# Altium project LM-004-B.PrjPcb
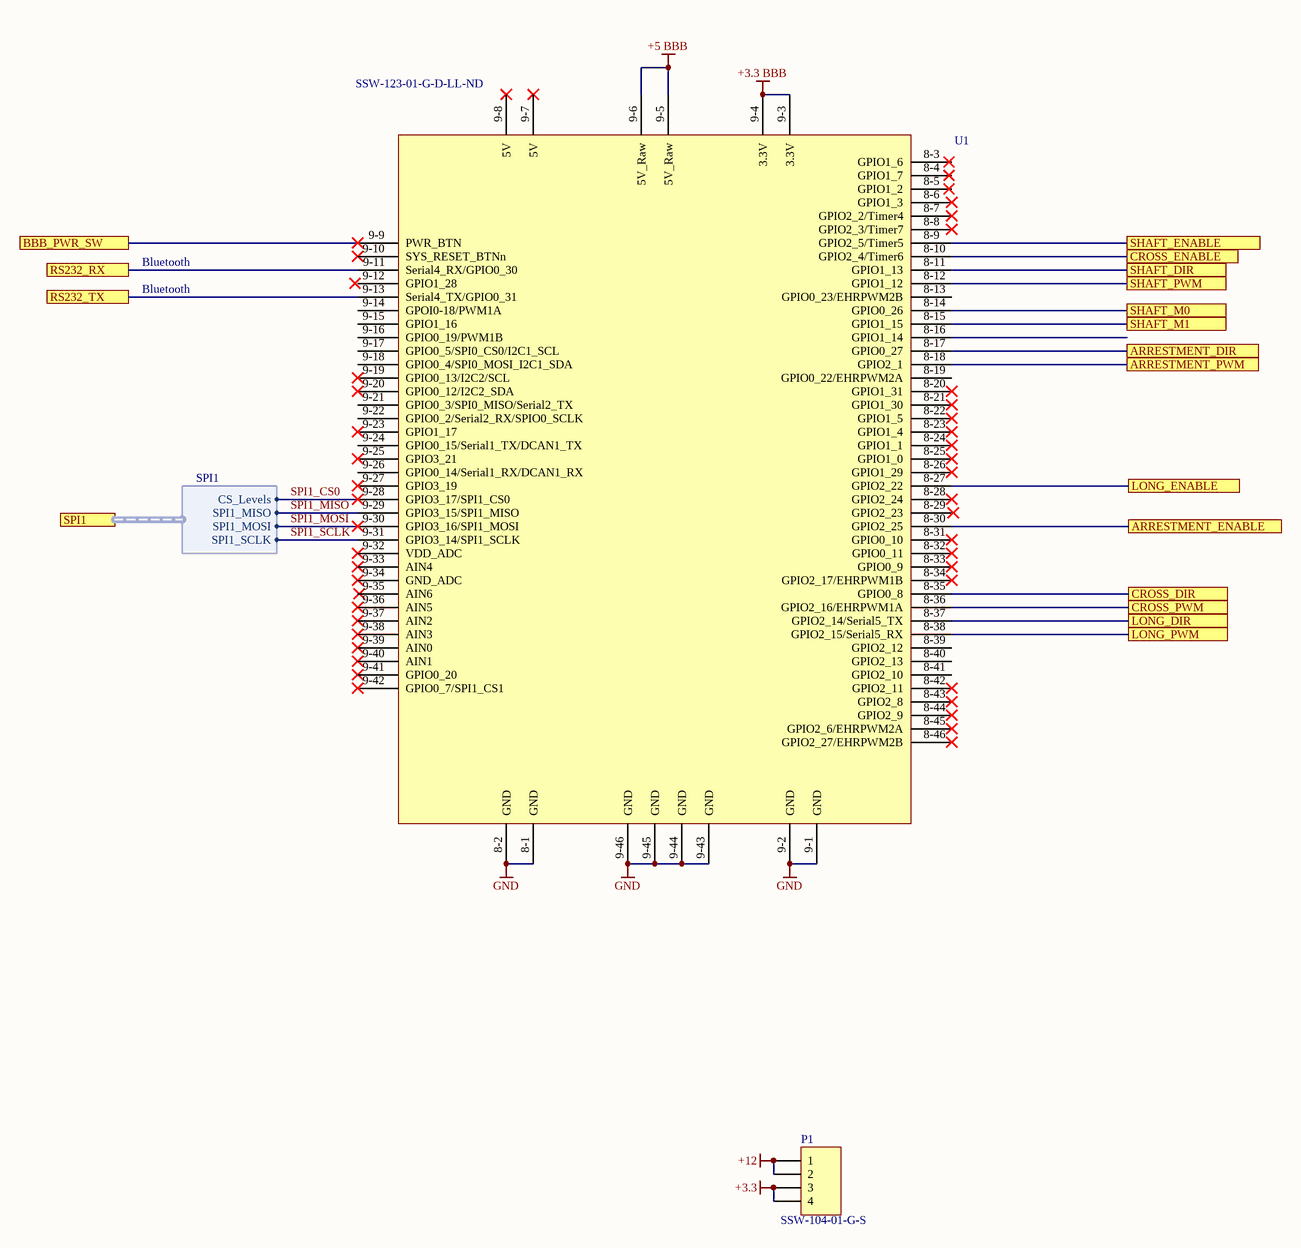
[diagram p0: BBB_Connections.SchDoc]
4 sheets, 42 parts. Net scope: flat (ports and power ports of the same name join across sheets).
Board file: LM-004-B.PcbDoc
Sheets:
  BBB_Connections.SchDoc
  Bluetooth.SchDoc
  Stepper Motor Driver.SchDoc
  Magnetic_Encoder.SchDoc

## Sheet BBB_Connections.SchDoc: BBB Connections
size Tabloid; DocumentNumber: LM-004; Revision: C; SheetNumber: 3; SheetTotal: 4

### Parts
P1  SSW-104-01-G-S  [HDR1X4]
U1  Supplier Part Number 1: SSW-123-01-G-D-LL-ND  [Beaglebone Black Mezanine]  (hidden comment: BBB)

### Ports
ARRESTMENT_DIR, ARRESTMENT_ENABLE, ARRESTMENT_PWM, BBB_PWR_SW, CROSS_DIR, CROSS_ENABLE, CROSS_PWM, LONG_DIR, LONG_ENABLE, LONG_PWM, RS232_RX, RS232_TX, SHAFT_DIR, SHAFT_ENABLE, SHAFT_M0, SHAFT_M1, SHAFT_PWM, SPI1 (harness SPI1)

### Harnesses
SPI1: CS_Levels, SPI1_MISO, SPI1_MOSI, SPI1_SCLK

### Nets
+3.3: P1.3 P1.4
+3.3 BBB: U1.9-3(3.3V) U1.9-4(3.3V)
+5 BBB: U1.9-5(5V_Raw) U1.9-6(5V_Raw)
+12: P1.1 P1.2
GND: U1.8-1(GND) U1.8-2(GND) U1.9-1(GND) U1.9-2(GND) U1.9-43(GND) U1.9-44(GND) U1.9-45(GND) U1.9-46(GND)
RS232_RX: U1.9-11(Serial4_RX/GPIO0_30) ; port RS232_RX
RS232_TX: U1.9-13(Serial4_TX/GPIO0_31) ; port RS232_TX
SPI1_CS0: U1.9-28(GPIO3_17/SPI1_CS0) ; port SPI1.CS_Levels
SPI1_MISO: U1.9-29(GPIO3_15/SPI1_MISO) ; port SPI1.SPI1_MISO
SPI1_MOSI: U1.9-30(GPIO3_16/SPI1_MOSI) ; port SPI1.SPI1_MOSI
SPI1_SCLK: U1.9-31(GPIO3_14/SPI1_SCLK) ; port SPI1.SPI1_SCLK
NetU1_8-9: U1.8-9(GPIO2_5/Timer5) ; port SHAFT_ENABLE
NetU1_8-10: U1.8-10(GPIO2_4/Timer6) ; port CROSS_ENABLE
NetU1_8-11: U1.8-11(GPIO1_13) ; port SHAFT_DIR
NetU1_8-12: U1.8-12(GPIO1_12) ; port SHAFT_PWM
NetU1_8-14: U1.8-14(GPIO0_26) ; port SHAFT_M0
NetU1_8-15: U1.8-15(GPIO1_15) ; port SHAFT_M1
NetU1_8-17: U1.8-17(GPIO0_27) ; port ARRESTMENT_DIR
NetU1_8-18: U1.8-18(GPIO2_1) ; port ARRESTMENT_PWM
NetU1_8-27: U1.8-27(GPIO2_22) ; port LONG_ENABLE
NetU1_8-30: U1.8-30(GPIO2_25) ; port ARRESTMENT_ENABLE
NetU1_8-35: U1.8-35(GPIO0_8) ; port CROSS_DIR
NetU1_8-36: U1.8-36(GPIO2_16/EHRPWM1A) ; port CROSS_PWM
NetU1_8-37: U1.8-37(GPIO2_14/Serial5_TX) ; port LONG_DIR
NetU1_8-38: U1.8-38(GPIO2_15/Serial5_RX) ; port LONG_PWM
NetU1_9-9: U1.9-9(PWR_BTN) ; port BBB_PWR_SW

Not connected (* = marked no-connect by the designer): U1 8-3(GPIO1_6) 8-4(GPIO1_7) 8-5(GPIO1_2) 8-6(GPIO1_3)* 8-7(GPIO2_2/Timer4)* 8-8(GPIO2_3/Timer7)* 8-13(GPIO0_23/EHRPWM2B) 8-16(GPIO1_14) 8-19(GPIO0_22/EHRPWM2A) 8-20(GPIO1_31)* 8-21(GPIO1_30)* 8-22(GPIO1_5)* 8-23(GPIO1_4)* 8-24(GPIO1_1)* 8-25(GPIO1_0)* 8-26(GPIO1_29)* 8-28(GPIO2_24)* 8-29(GPIO2_23) 8-31(GPIO0_10)* 8-32(GPIO0_11)* 8-33(GPIO0_9)* 8-34(GPIO2_17/EHRPWM1B)* 8-39(GPIO2_12) 8-40(GPIO2_13) 8-41(GPIO2_10) 8-42(GPIO2_11)* 8-43(GPIO2_8)* 8-44(GPIO2_9)* 8-45(GPIO2_6/EHRPWM2A)* 8-46(GPIO2_27/EHRPWM2B)* 9-7(5V)* 9-8(5V)* 9-10(SYS_RESET_BTNn)* 9-12(GPIO1_28) 9-14(GPOI0-18/PWM1A) 9-15(GPIO1_16) 9-16(GPIO0_19/PWM1B) 9-17(GPIO0_5/SPI0_CS0/I2C1_SCL) 9-18(GPIO0_4/SPI0_MOSI_I2C1_SDA) 9-19(GPIO0_13/I2C2/SCL)* 9-20(GPIO0_12/I2C2_SDA)* 9-21(GPIO0_3/SPI0_MISO/Serial2_TX) 9-22(GPIO0_2/Serial2_RX/SPIO0_SCLK) 9-23(GPIO1_17)* 9-24(GPIO0_15/Serial1_TX/DCAN1_TX) 9-25(GPIO3_21)* 9-26(GPIO0_14/Serial1_RX/DCAN1_RX) 9-27(GPIO3_19)* 9-32(VDD_ADC)* 9-33(AIN4)* 9-34(GND_ADC)* 9-35(AIN6) 9-36(AIN5)* 9-37(AIN2)* 9-38(AIN3)* 9-39(AIN0)* 9-40(AIN1)* 9-41(GPIO0_20)* 9-42(GPIO0_7/SPI1_CS1)*

### Notes on the sheet
- Bluetooth
- Title
- Size:
- Date:
- Tabloid
- Number:
- Time:
- Revision:
- Sheet
- of
- ZLS Corporation
- 7801 North Lamar Blvd.
- Suite E-184
- Austin, Texas 78752  USA
- (512) 453-0288
- File:

### Library data of the parts
P1 = Header 4: Header, 4-Pin; Manufacturer: Samtec Inc.; Connector Type: Receptacle; Style: Board to Board or Cable; Number of Positions: 4; Number of Positions Loaded: All; Pitch - Mating: 0.100" (2.54mm); Contact Length - Post: 0.104" (2.64mm); Material Flammability Rating: UL94 V-0; Current Rating: 5.7A per Contact; Supplier 1: Digi-Key; Supplier Part Number 1: SAM1209-04-ND; Manufacturer Part Number: SSW-104-01-G-S; RoHS: RoHS Compliant; Category: Connectors, Interconnects; Stock 1: 360; Pricing 1: 1=1.85, 10=1.654, 100=1.3623, 500=1.07684, 1000=0.9244, 5000=0.84331, 10000=0.81088 (USD); Packaging: Bulk; Part Status: Active; Contact Type: Forked; Row Spacing - Mating: -; Mounting Type: Through Hole; Termination: Solder; Fastening Type: Push-Pull; Contact Finish - Mating: Gold; Contact Finish Thickness - Mating: 20.0µin (0.51µm); Insulation Color: Black; Insulation Height: 0.335" (8.51mm); Operating Temperature: -55°C ~ 125°C; Contact Finish - Post: Gold; Mated Stacking Heights: -; Ingress Protection: -; Features: -; Voltage Rating: -; Applications: -; Insulation Material: Liquid Crystal Polymer (LCP); Contact Shape: Square; Contact Material: Phosphor Bronze; Contact Finish Thickness - Post: 3.00µin (0.076µm); ComponentLink1URL: http://suddendocs.samtec.com/prints/ssw-1xx-xx-xxx-x-xx-xxx-xx-mkt.pdf; ComponentLink1Description: http://suddendocs.samtec.com/prints/ssw-1xx-xx-xxx-x-xx-xxx-xx-mkt.pdf
U1 = Beaglebone_Black_Mezanine: Beaglebone Black; Manufacturer: Samtec Inc.; Manufacturer Part Number: SSW-123-01-G-D-LL; Connector Type: Receptacle; Style: Board to Board or Cable; Number of Positions: 46; Number of Positions Loaded: All; Pitch - Mating: 0.100" (2.54mm); Contact Length - Post: 0.104" (2.64mm); Material Flammability Rating: UL94 V-0; Current Rating: 5.7A per Contact; Supplier 1: Digi-Key; RoHS: RoHS Compliant; Category: Connectors, Interconnects; Stock 1: 0; Pricing 1: 1=6.07 (USD); Packaging: Bulk; Part Status: Active; Contact Type: Forked; Row Spacing - Mating: 0.100" (2.54mm); Mounting Type: Through Hole; Termination: Kinked Pin, Solder; Fastening Type: Push-Pull; Contact Finish - Mating: Gold; Contact Finish Thickness - Mating: 20.0µin (0.51µm); Insulation Color: Black; Insulation Height: 0.335" (8.51mm); Operating Temperature: -55°C ~ 125°C; Contact Finish - Post: Gold; Mated Stacking Heights: -; Ingress Protection: -; Features: -; Voltage Rating: -; Applications: -; Insulation Material: Liquid Crystal Polymer (LCP); Contact Shape: Square; Contact Material: Phosphor Bronze; Contact Finish Thickness - Post: 3.00µin (0.076µm)

## Sheet Bluetooth.SchDoc: Bluetooth
size OrCAD A; DocumentNumber: LM-004; Revision: C; SheetNumber: 4; SheetTotal: 4
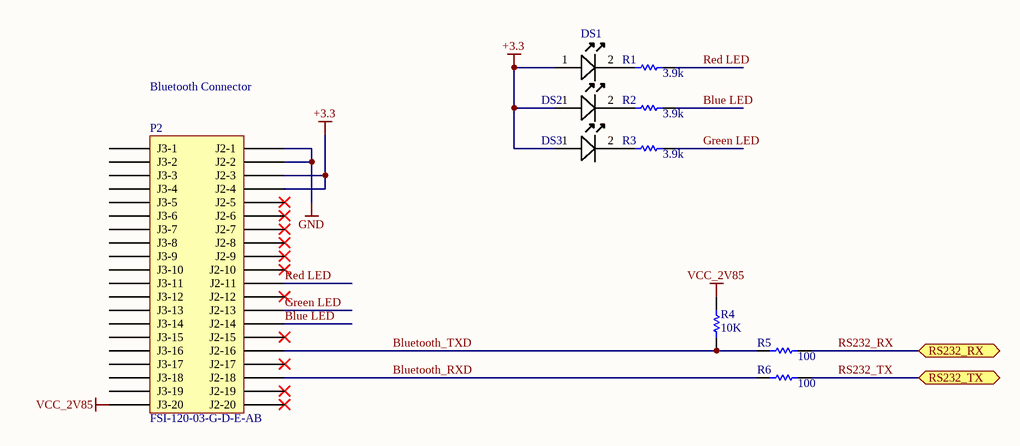
[diagram p1: Bluetooth.SchDoc]

### Parts
DS1  Lite-On LTST-S220KGKT Green LED, 571 nm 2012 (0805) Side View, Rectangle Lens SMD package  [0805C_L]  (value not drawn)
DS2  Lite-On LTST-S220KGKT Green LED, 571 nm 2012 (0805) Side View, Rectangle Lens SMD package  [0805C_L]  (value not drawn)
DS3  Lite-On LTST-S220KGKT Green LED, 571 nm 2012 (0805) Side View, Rectangle Lens SMD package  [0805C_L]  (value not drawn)
P2  FSI-120-03-G-D-E-AB  [FSI-120-03-G-D-E-AB]
R1  3.9k  [RESC0805(2012)_L]
R2  3.9k  [RESC0805(2012)_L]
R3  3.9k  [RESC0805(2012)_L]
R4  10K  [RESC0805(2012)_L]
R5  100  [RESC0805(2012)_L]
R6  100  [RESC0805(2012)_L]

### Ports
RS232_RX, RS232_TX

### Nets
+3.3: DS1.1(A) DS2.1(A) DS3.1(A) P2.J2-3 P2.J2-4
GND: P2.J2-1 P2.J2-2
VCC_2V85: P2.J3-20 R4.1
Blue LED: P2.J2-14 R2.1
Bluetooth_RXD: P2.J2-18 R6.2
Bluetooth_TXD: P2.J2-16 R4.2 R5.2
Green LED: P2.J2-13 R3.1
Red LED: P2.J2-11 R1.1
RS232_RX: R5.1 ; port RS232_RX
RS232_TX: R6.1 ; port RS232_TX
NetDS1_2: DS1.2(K) R1.2
NetDS2_2: DS2.2(K) R2.2
NetDS3_2: DS3.2(K) R3.2

Not connected (* = marked no-connect by the designer): P2 J2-5* J2-6* J2-7* J2-8* J2-9* J2-10* J2-12* J2-15* J2-17* J2-19* J2-20* J3-1 J3-2 J3-3 J3-4 J3-5 J3-6 J3-7 J3-8 J3-9 J3-10 J3-11 J3-12 J3-13 J3-14 J3-15 J3-16 J3-17 J3-18 J3-19

### Notes on the sheet
- Bluetooth Connector
- Title
- Size:
- Date:
- Orcad A
- Number:
- Time:
- Revision:
- Sheet
- of
- ZLS Corporation
- 7801 North Lamar Blvd.
- Suite E-184
- Austin, Texas 78752  USA
- (512) 453-0288
- File:

### Library data of the parts
DS1-DS3 = LED A/K: Manufacturer: Vishay / Lite-On; Lens Colour: Colorless; Viewing Angle: 130°; Luminous Intensity: 35mcd; Forward Current: 20mA; Forward Voltage: 2V; Lens Style: Diffused,Colorless; Power Rating: 75mW; Dominant Wavelength: 568nm; Lens Transparency: Clear; Number of Elements: 1; Power Dissipation: 75W; Wavelength: 574nm; Supplier 1: Digi-Key; Supplier Part Number 1: 160-1468-1-ND; Manufacturer Part Number: LTST-S220KGKT; Stock 1: 74800; Pricing 1: 1=0.29, 10=0.212, 25=0.1564, 100=0.1117, 250=0.0759, 500=0.067, 1000=0.0525 (USD); Mount: Surface Mount; Case/Package: 0805; Number of Pins: 2; Colour: Green; Case Code (Metric): 2012; Case Code (Imperial): 0805; Min Operating Temperature: -55°C; Max Operating Temperature: 85°C; Packaging: Tape and Reel; Package Quantity: 4000; Illumination Colour: Green; Test Current: 20mA; Number of LEDs: 1; Length: 2.1mm; Height: 0.6mm; Width: 1mm; Depth: 0.6mm; Radiation Hardening: No; Lead Free: Lead Free; ComponentLink1URL: https://datasheet.ciiva.com/11775/0900766b80dc0b70-11775441.pdf; ComponentLink1Description: https://datasheet.ciiva.com/11775/0900766b80dc0b70-11775441.pdf; ComponentLink2URL: https://datasheet.ciiva.com/2110/s-110-ltst-s220kgkt-2110069.pdf; ComponentLink2Description: https://datasheet.ciiva.com/2110/s-110-ltst-s220kgkt-2110069.pdf; ComponentLink3URL: https://datasheet.ciiva.com/2110/s-110-ltst-s220kgkt-2110070.pdf; ComponentLink3Description: https://datasheet.ciiva.com/2110/s-110-ltst-s220kgkt-2110070.pdf; ComponentLink4URL: https://datasheet.ciiva.com/12400/100-ltst-s220kgkt-59602-12400886.pdf; ComponentLink4Description: https://datasheet.ciiva.com/12400/100-ltst-s220kgkt-59602-12400886.pdf; ComponentLink5URL: https://datasheet.ciiva.com/2110/s-110-ltst-s220kgkt-2110071.pdf; ComponentLink5Description: https://datasheet.ciiva.com/2110/s-110-ltst-s220kgkt-2110071.pdf; ComponentLink6URL: https://datasheet.ciiva.com/16379/ltst-s220kgkt-16379082.pdf; ComponentLink6Description: https://datasheet.ciiva.com/16379/ltst-s220kgkt-16379082.pdf; Supplier 2: Farnell; Supplier Part Number 2: 2062310; RoHS: YES; Stock 2: 2271; Pricing 2: 1=0.325, 10=0.317, 100=0.23, 200=0.228, 400=0.182, 900=0.147, 3000=0.114, 9000=0.107 (GBP); ComponentLink7URL: http://www.farnell.com/cad/2124774.pdf; ComponentLink7Description: http://www.farnell.com/cad/2124774.pdf; ComponentLink8URL: http://www.farnell.com/datasheets/693084.pdf; ComponentLink8Description: http://www.farnell.com/datasheets/693084.pdf
R1-R3 = CMP-1013-00215-1: 2R55 0.125W 1% 0805 (2012 Metric)  SMD; Case-Metric: 2012; Case-EIA: 0805; Value: 3.9k; Tolerance: 1 %; Technology: SMT; Power: 0.125 W
R4-R6 = CMP-1013-00215-1: 2R55 0.125W 1% 0805 (2012 Metric)  SMD; Case-Metric: 2012; Value: 3.9k; Case-EIA: 0805; Tolerance: 1 %; Technology: SMT; Power: 0.125 W
P2 = FSI-120-03-G-D-E-AB: Supplier 1: Avnet; Supplier Part Number 1: FSI-120-03-G-D-E-AB

## Sheet Stepper Motor Driver.SchDoc: Stepper Motor Driver
size Tabloid; DocumentNumber: LM-004; Revision: C; SheetNumber: 3; SheetTotal: 3
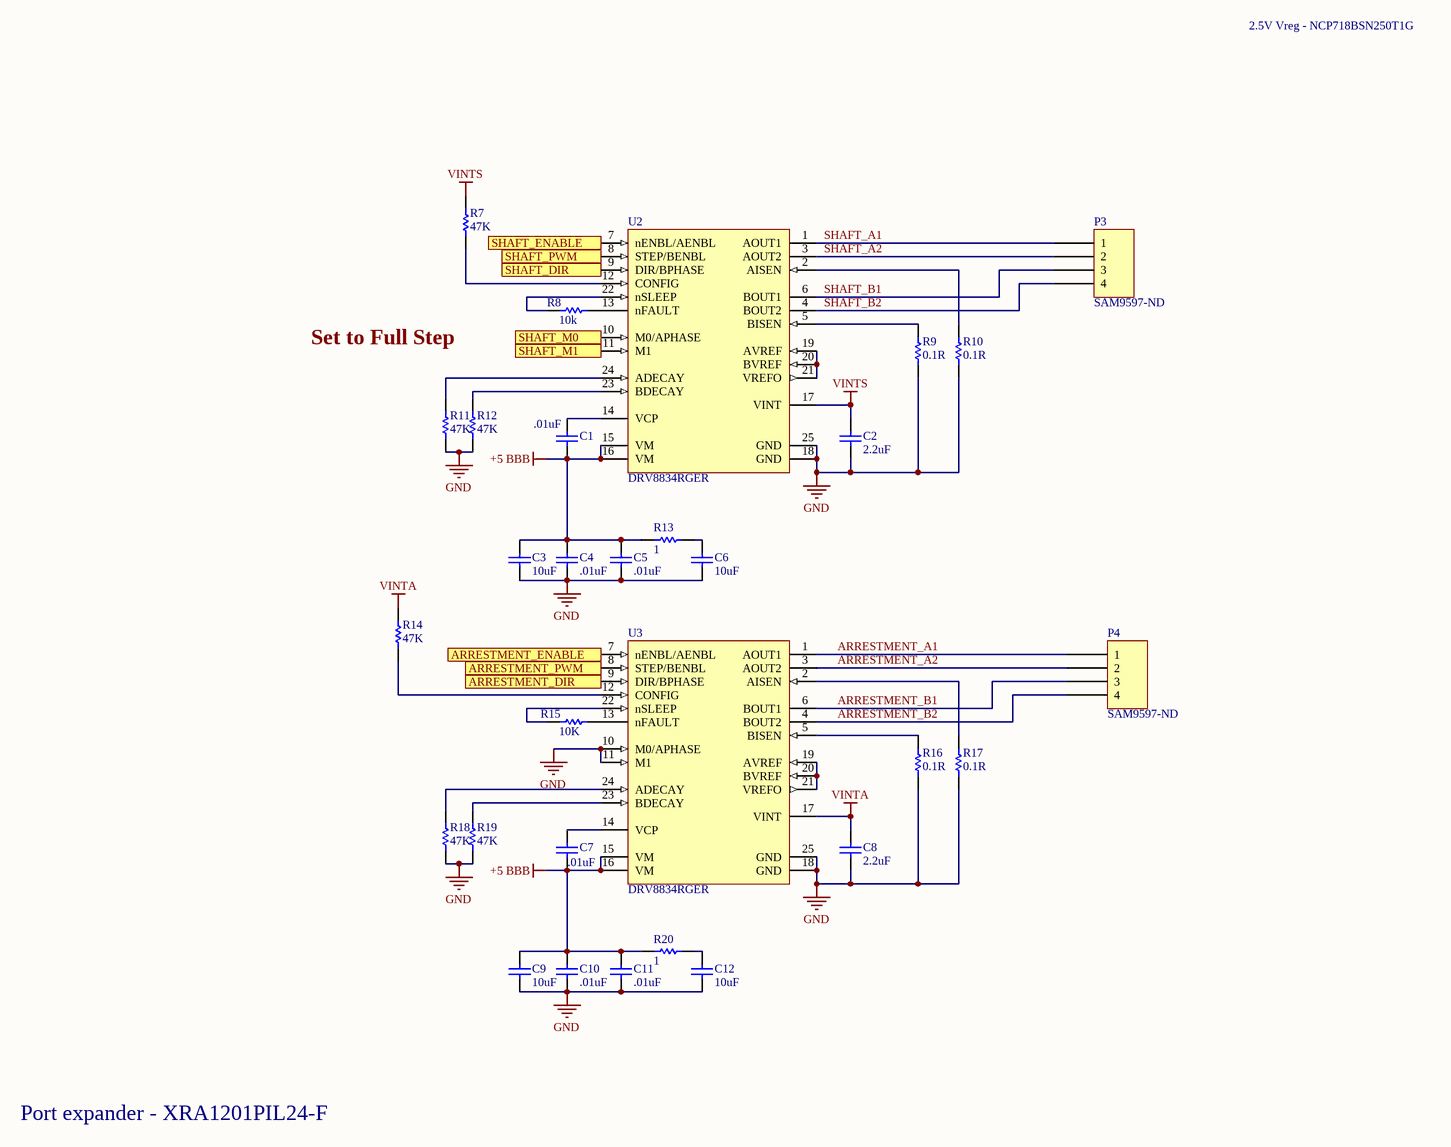
[diagram p2: Stepper Motor Driver.SchDoc]

### Parts
C1  .01uF  [CAPC0402(1005)60_N]
C2  2.2uF  [CAPC0402(1005)60_N]
C3  10uF  [CAPC0402(1005)60_N]
C4  .01uF  [CAPC0402(1005)60_N]
C5  .01uF  [CAPC0402(1005)60_N]
C6  10uF  [CAPC0402(1005)60_N]
C7  .01uF  [CAPC0402(1005)60_N]
C8  2.2uF  [CAPC0402(1005)60_N]
C9  10uF  [CAPC0402(1005)60_N]
C10  .01uF  [CAPC0402(1005)60_N]
C11  .01uF  [CAPC0402(1005)60_N]
C12  10uF  [CAPC0402(1005)60_N]
P3  Supplier Part Number 1: SAM9597-ND  [IPL1-104-01-L-S-RA-K]  (hidden comment: IPL1-104-01-L-S-RA-K)
P4  Supplier Part Number 1: SAM9597-ND  [IPL1-104-01-L-S-RA-K]  (hidden comment: IPL1-104-01-L-S-RA-K)
R7  47K  [RESC0402(1005)_M]
R8  10k  [RESC0402(1005)_M]
R9  0.1R  [RESC0402(1005)_M]
R10  0.1R  [RESC0402(1005)_M]
R11  47K  [RESC0402(1005)_M]
R12  47K  [RESC0402(1005)_M]
R13  1  [RESC0402(1005)_M]
R14  47K  [RESC0402(1005)_M]
R15  10K  [RESC0402(1005)_M]
R16  0.1R  [RESC0402(1005)_M]
R17  0.1R  [RESC0402(1005)_M]
R18  47K  [RESC0402(1005)_M]
R19  47K  [RESC0402(1005)_M]
R20  1  [RESC0402(1005)_M]
U2  DRV8834RGER  [RGE0024B_V]
U3  DRV8834RGER  [RGE0024B_V]

### Ports
ARRESTMENT_DIR, ARRESTMENT_ENABLE, ARRESTMENT_PWM, SHAFT_DIR, SHAFT_ENABLE, SHAFT_M0, SHAFT_M1, SHAFT_PWM

### Nets
+5 BBB: C1.1 C3.2 C4.2 C5.2 C7.1 C9.2 C10.2 C11.2 R13.1 R20.1 U2.15(VM) U2.16(VM) U3.15(VM) U3.16(VM)
GND: C2.1 C3.1 C4.1 C5.1 C6.1 C8.1 C9.1 C10.1 C11.1 C12.1 R9.2 R10.2 R11.2 R12.2 R16.2 R17.2 R18.2 R19.2 U2.18(GND) U2.25(GND) U3.10(M0/APHASE) U3.11(M1) U3.18(GND) U3.25(GND)
VINTA: C8.2 R14.1 U3.17(VINT)
VINTS: C2.2 R7.1 U2.17(VINT)
ARRESTMENT_A1: P4.1 U3.1(AOUT1)
ARRESTMENT_A2: P4.2 U3.3(AOUT2)
ARRESTMENT_B1: P4.3 U3.6(BOUT1)
ARRESTMENT_B2: P4.4 U3.4(BOUT2)
SHAFT_A1: P3.1 U2.1(AOUT1)
SHAFT_A2: P3.2 U2.3(AOUT2)
SHAFT_B1: P3.3 U2.6(BOUT1)
SHAFT_B2: P3.4 U2.4(BOUT2)
NetC1_2: C1.2 U2.14(VCP)
NetC6_2: C6.2 R13.2
NetC7_2: C7.2 U3.14(VCP)
NetC12_2: C12.2 R20.2
NetR7_2: R7.2 U2.12(CONFIG)
NetR8_1: R8.1 U2.22(nSLEEP)
NetR8_2: R8.2 U2.13(nFAULT)
NetR9_1: R9.1 U2.5(BISEN)
NetR10_1: R10.1 U2.2(AISEN)
NetR11_1: R11.1 U2.24(ADECAY)
NetR12_1: R12.1 U2.23(BDECAY)
NetR14_2: R14.2 U3.12(CONFIG)
NetR15_1: R15.1 U3.22(nSLEEP)
NetR15_2: R15.2 U3.13(nFAULT)
NetR16_1: R16.1 U3.5(BISEN)
NetR17_1: R17.1 U3.2(AISEN)
NetR18_1: R18.1 U3.24(ADECAY)
NetR19_1: R19.1 U3.23(BDECAY)
NetU1_8-9: U2.7(nENBL/AENBL) ; port SHAFT_ENABLE
NetU1_8-11: U2.9(DIR/BPHASE) ; port SHAFT_DIR
NetU1_8-12: U2.8(STEP/BENBL) ; port SHAFT_PWM
NetU1_8-14: U2.10(M0/APHASE) ; port SHAFT_M0
NetU1_8-15: U2.11(M1) ; port SHAFT_M1
NetU1_8-17: U3.9(DIR/BPHASE) ; port ARRESTMENT_DIR
NetU1_8-18: U3.8(STEP/BENBL) ; port ARRESTMENT_PWM
NetU1_8-30: U3.7(nENBL/AENBL) ; port ARRESTMENT_ENABLE
NetU2_19: U2.19(AVREF) U2.20(BVREF) U2.21(VREFO)
NetU3_19: U3.19(AVREF) U3.20(BVREF) U3.21(VREFO)

### Notes on the sheet
- 2.5V Vreg - NCP718BSN250T1G
- Set to Full Step
- Port expander - XRA1201PIL24-F
- Title
- Size:
- Date:
- Tabloid
- Number:
- Time:
- Revision:
- Sheet
- of
- ZLS Corporation
- 7801 North Lamar Blvd.
- Suite E-184
- Austin, Texas 78752  USA
- (512) 453-0288
- File:

### Library data of the parts
C1-C12 = CMP-1034-01365-1: CAP 220pF 25V ±10% 0402 (1005 Metric) Thickness 0.6mm SMD
R7-R20 = CMP-1011-00463-1
U2 U3 = CMP-1685-00004-1: Dual-Bridge Stepper or DC Motor Driver, 2.5 to 10.8 V, -40 to 85 degC, 24-pin QFN (RGE), Green (RoHS & no Sb/Br), Tape and Reel; Min Supply Voltage: 2.5 V; Output Current: 1.5 A; Nominal Supply Current: 4 mA; Max Operating Temperature: 85 degC; Pins: 24; Packaging: Tape and Reel; ComponentLink2Description: Datasheet; ComponentLink2URL: http://www.ti.com/general/docs/lit/getliterature.tsp?genericPartNumber=DRV8834&fileType=pdf; Mounting Technology: Surface Mount; ComponentLink1URL: http://www.ti.com/; Package Quantity: 3000; Mount: Surface Mount; Min Operating Temperature: -40 degC; RoHSCompliant: true; Radiation Hardening: No; PackageDescription: 24-Pin Quad Flat No-lead Package, Body 4 x 4 mm, Pitch 0.5 mm; DatasheetVersion: SLVSB19D, 03/2015; PackageReference: RGE0024B; ComponentLink1Description: Manufacturer URL
P3 P4 = IPL1-104-01-L-S-RA-K: Supplier 1: Digi-Key

## Sheet Magnetic_Encoder.SchDoc: Magnetic Encoder
size OrCAD A
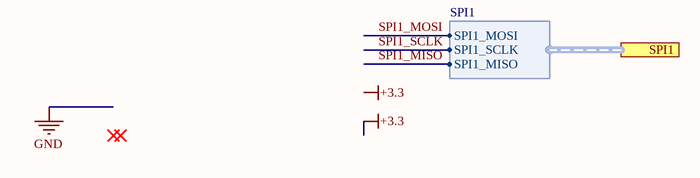
[diagram p3: Magnetic_Encoder.SchDoc]

### Ports
SPI1 (harness SPI1)

### Harnesses
SPI1: SPI1_MISO, SPI1_MOSI, SPI1_SCLK

### Notes on the sheet
- Labels drawn without touching a wire or pin: +3.3
- Title
- Size:
- Date:
- Orcad A
- Number:
- Time:
- Revision:
- Sheet
- of
- ZLS Corporation
- 7801 North Lamar Blvd.
- Suite E-184
- Austin, Texas 78752  USA
- (512) 453-0288
- File:

## Nets that join several sheets
+3.3: BBB_Connections (P1.3 P1.4), Bluetooth (5 pins)
+5 BBB: BBB_Connections (U1.9-5 U1.9-6), Stepper Motor Driver (14 pins)
GND: BBB_Connections (8 pins), Bluetooth (P2.J2-1 P2.J2-2), Stepper Motor Driver (24 pins)
NetU1_8-9: BBB_Connections (U1.8-9), Stepper Motor Driver (U2.7)
NetU1_8-11: BBB_Connections (U1.8-11), Stepper Motor Driver (U2.9)
NetU1_8-12: BBB_Connections (U1.8-12), Stepper Motor Driver (U2.8)
NetU1_8-14: BBB_Connections (U1.8-14), Stepper Motor Driver (U2.10)
NetU1_8-15: BBB_Connections (U1.8-15), Stepper Motor Driver (U2.11)
NetU1_8-17: BBB_Connections (U1.8-17), Stepper Motor Driver (U3.9)
NetU1_8-18: BBB_Connections (U1.8-18), Stepper Motor Driver (U3.8)
NetU1_8-30: BBB_Connections (U1.8-30), Stepper Motor Driver (U3.7)
RS232_RX: BBB_Connections (U1.9-11), Bluetooth (R5.1)
RS232_TX: BBB_Connections (U1.9-13), Bluetooth (R6.1)